# EAGLE design CPU_HCS12C (EAGLE 6.5.0)
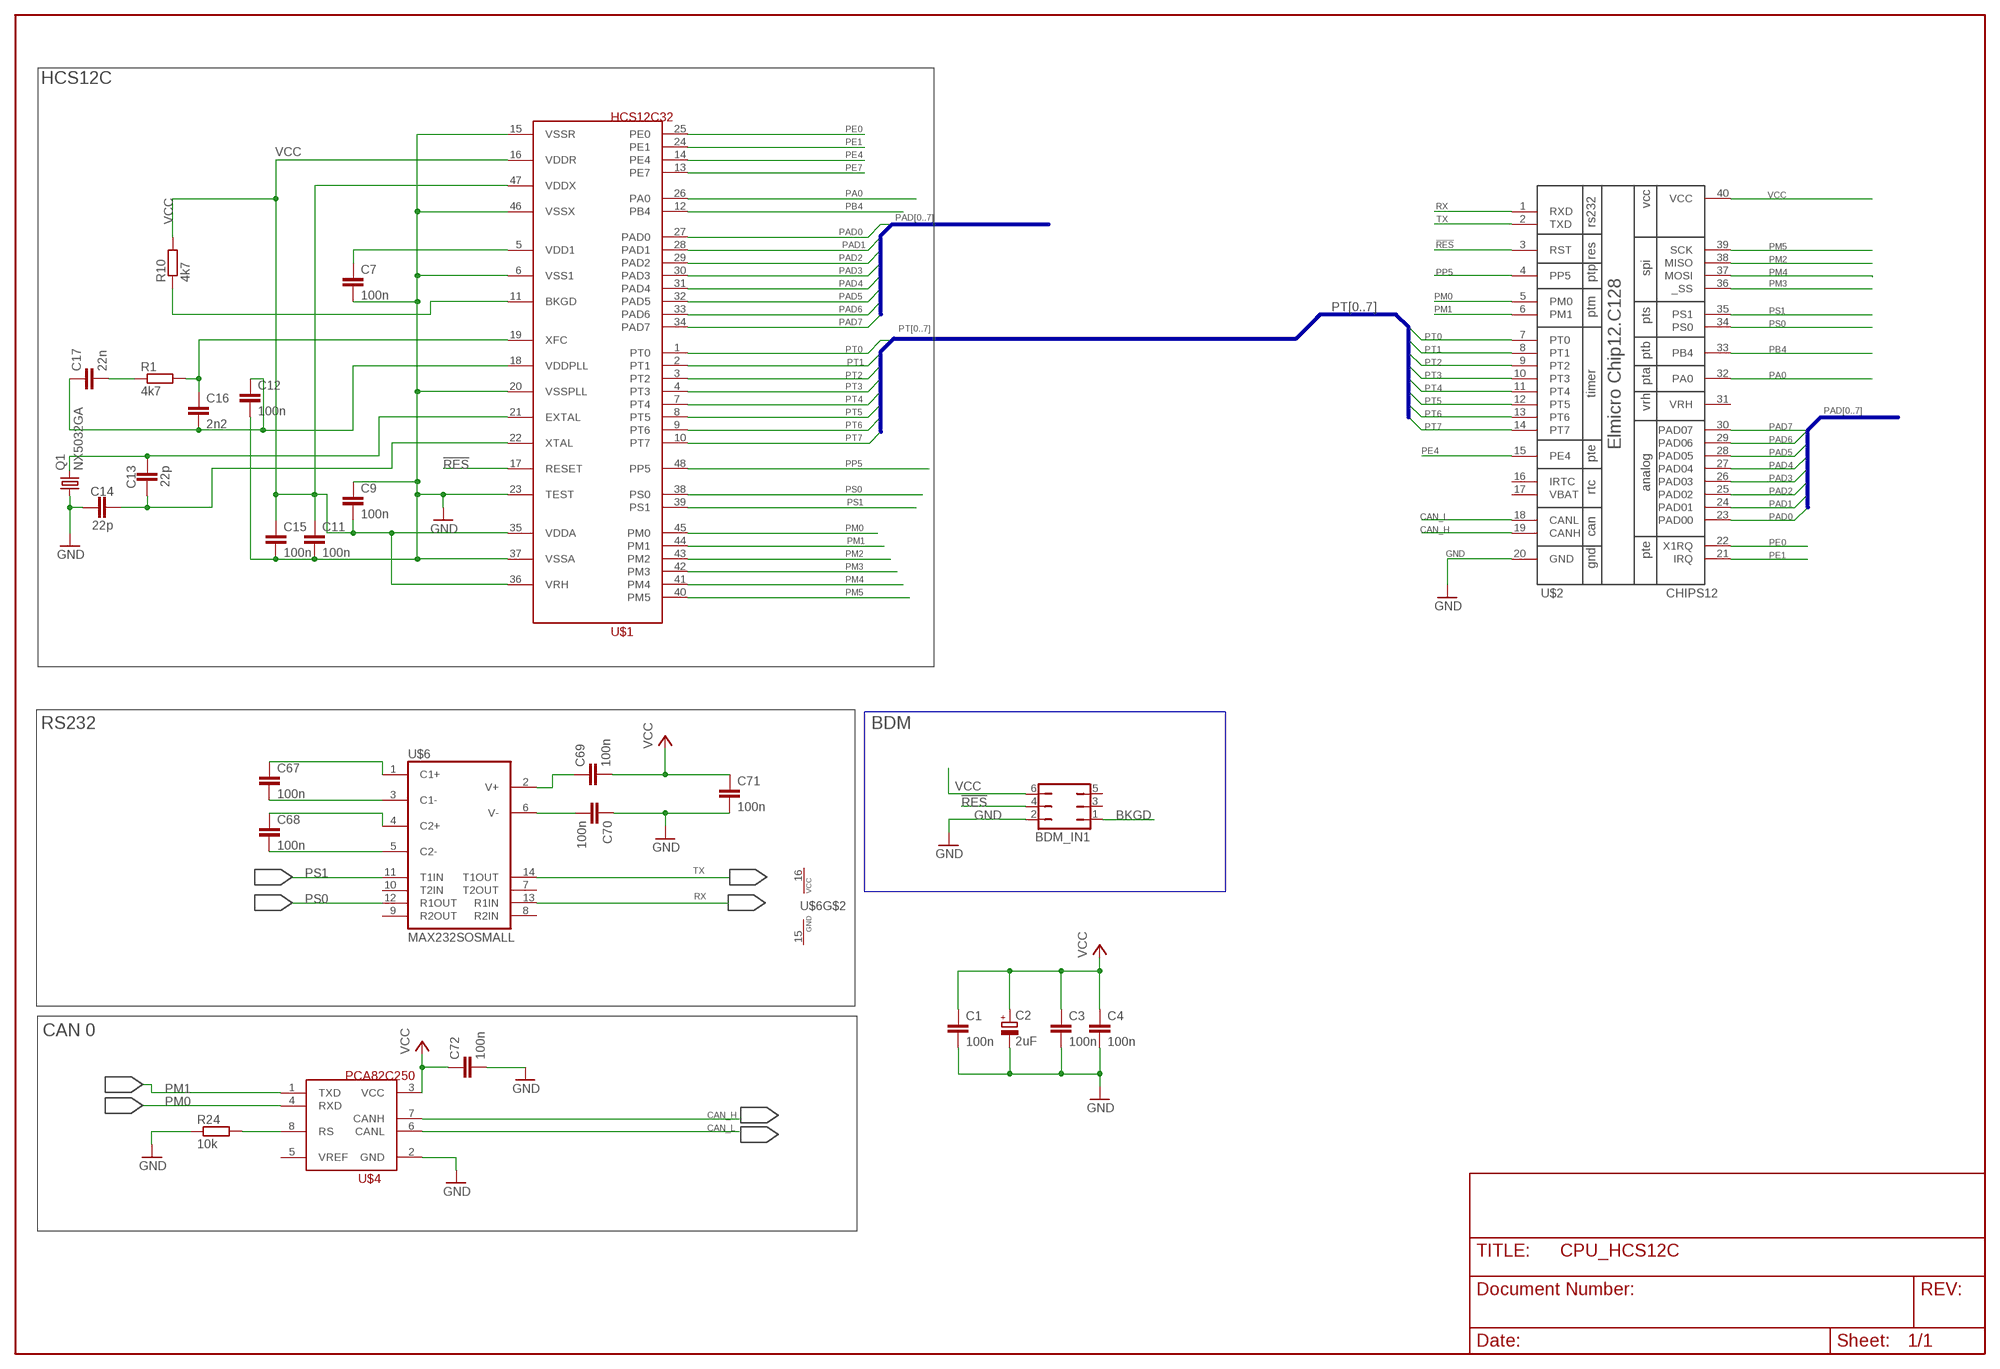
[diagram p0: schematic, sheet 1]

## Parts
BDM_IN1  JP3Q  [JP3Q]
C1  100n  C-EUC0805  [C0805]
C2  2uF  CPOL-EUCT3528  [CT3528]
C3  100n  C-EUC0805  [C0805]
C4  100n  C-EUC0805  [C0805]
C7  100n  C-EUC0603  [C0603]
C9  100n  C-EUC0603  [C0603]
C11  100n  C-EUC0603  [C0603]
C12  100n  C-EUC0603  [C0603]
C13  22p  C-EUC0805K  [C0805K]
C14  22p  C-EUC0805K  [C0805K]
C15  100n  C-EUC0603  [C0603]
C16  2n2  C-EUC0603  [C0603]
C17  22n  C-EUC0603  [C0603]
C67  100n  C-EUC0805  [C0805]
C68  100n  C-EUC0805  [C0805]
C69  100n  C-EUC0805  [C0805]
C70  100n  C-EUC0805  [C0805]
C71  100n  C-EUC0805  [C0805]
C72  100n  C-EUC0805  [C0805]
Q1  NX5032GA  [5032]
R1  4k7  R-EU_M0805  [M0805]
R10  4k7  R-EU_M0805  [M0805]
R24  10k  R-EU_M0805  [M0805]
U$1  HCS12C32  [LQFP48]
U$2  CHIPS12  [DIL40]
U$4  PCA82C250  [SO8@1]
U$6  MAX232SOSMALL  [SO16]

## Nets
!RES: BDM_IN1.4 U$1.17(RESET) U$2.3(RST)
BKGD: BDM_IN1.1 R10.1 U$1.11(BKGD)
CAN_H: U$2.19(CANH) U$4.7(CANH)
CAN_L: U$2.18(CANL) U$4.6(CANL)
GND: BDM_IN1.2 C1.2 C2.- C3.2 C4.2 C7.2 C9.1 C11.2 C12.2 C14.2 C15.2 C70.1 C71.2 C72.2 Q1.1 R24.1 U$1.6(VSS1) U$1.15(VSSR) U$1.20(VSSPLL) U$1.23(TEST) U$1.37(VSSA) U$1.46(VSSX) U$2.20(GND) U$4.2(GND)
N$2: C7.1 U$1.5(VDD1)
N$3: C13.1 Q1.2 U$1.21(EXTAL)
N$4: C68.1 U$6.4(C2+)
N$6: C16.1 R1.2 U$1.19(XFC)
N$7: C12.1 C16.2 C17.1 U$1.18(VDDPLL)
N$8: C17.2 R1.1
N$10: C13.2 C14.1 U$1.22(XTAL)
N$11: C67.1 U$6.1(C1+)
N$13: C67.2 U$6.3(C1-)
N$54: C68.2 U$6.5(C2-)
N$55: C70.2 U$6.6(V-)
N$56: C69.1 U$6.2(V+)
N$57: R24.2 U$4.8(RS)
PA0: U$1.26(PA0) U$2.32(PA0)
PAD0: U$1.27(PAD0) U$2.23(PAD00)
PAD1: U$1.28(PAD1) U$2.24(PAD01)
PAD2: U$1.29(PAD2) U$2.25(PAD02)
PAD3: U$1.30(PAD3) U$2.26(PAD03)
PAD4: U$1.31(PAD4) U$2.27(PAD04)
PAD5: U$1.32(PAD5) U$2.28(PAD05)
PAD6: U$1.33(PAD6) U$2.29(PAD06)
PAD7: U$1.34(PAD7) U$2.30(PAD07)
PB4: U$1.12(PB4) U$2.33(PB4)
PE0: U$1.25(PE0) U$2.22(X1RQ)
PE1: U$1.24(PE1) U$2.21(IRQ)
PE4: U$1.14(PE4) U$2.15(PE4)
PE7: U$1.13(PE7)
PM0: U$1.45(PM0) U$2.5(PM0) U$4.4(RXD)
PM1: U$1.44(PM1) U$2.6(PM1) U$4.1(TXD)
PM2: U$1.43(PM2) U$2.38(MISO)
PM3: U$1.42(PM3) U$2.36(_SS)
PM4: U$1.41(PM4) U$2.37(MOSI)
PM5: U$1.40(PM5) U$2.39(SCK)
PP5: U$1.48(PP5) U$2.4(PP5)
PS0: U$1.38(PS0) U$2.34(PS0) U$6.12(R1OUT)
PS1: U$1.39(PS1) U$2.35(PS1) U$6.11(T1IN)
PT0: U$1.1(PT0) U$2.7(PT0)
PT1: U$1.2(PT1) U$2.8(PT1)
PT2: U$1.3(PT2) U$2.9(PT2)
PT3: U$1.4(PT3) U$2.10(PT3)
PT4: U$1.7(PT4) U$2.11(PT4)
PT5: U$1.8(PT5) U$2.12(PT5)
PT6: U$1.9(PT6) U$2.13(PT6)
PT7: U$1.10(PT7) U$2.14(PT7)
RX: U$2.1(RXD) U$6.13(R1IN)
TX: U$2.2(TXD) U$6.14(T1OUT)
VCC: BDM_IN1.6 C1.1 C2.+ C3.1 C4.1 C9.2 C11.1 C15.1 C69.2 C71.1 C72.1 R10.2 U$1.16(VDDR) U$1.35(VDDA) U$1.36(VRH) U$1.47(VDDX) U$2.40(VCC) U$4.3(VCC)
Unconnected: BDM_IN1.3 BDM_IN1.5 U$2.16(IRTC) U$2.17(VBAT) U$2.31(VRH) U$4.5(VREF) U$6.7(T2OUT) U$6.8(R2IN) U$6.9(R2OUT) U$6.10(T2IN)

## Buses
B$1
PT[0..7]
PAD[0..7]

## Notes on the sheet
- HCS12C
- RS232 | BDM
- CAN 0

## Power pins joined to a net without a drawn wire
GND: U$6.15(GND)
VCC: U$6.16(VCC)

## Library data of the parts
BDM_IN1 = jumper:JP3Q: JUMPER
C1 C3 C4 C7 C9 C11-C17 C67-C72 = rcl:C-EU: CAPACITOR, European symbol
C2 = rcl:CPOL-EU: POLARIZED CAPACITOR, European symbol
Q1 = crystal:NX5032GA
R1 R10 R24 = rcl:R-EU_: RESISTOR, European symbol
U$1 = Freescale_HCS12C:HCS12C32
U$2 = elmicro:CHIPS12: ChipS12.128 from Elmicro (www.elmicro.com)
U$4 = philips:PCA82C250: CAN Phy Driver SMD
U$6 = maxim:MAX232SOSMALL

## Board
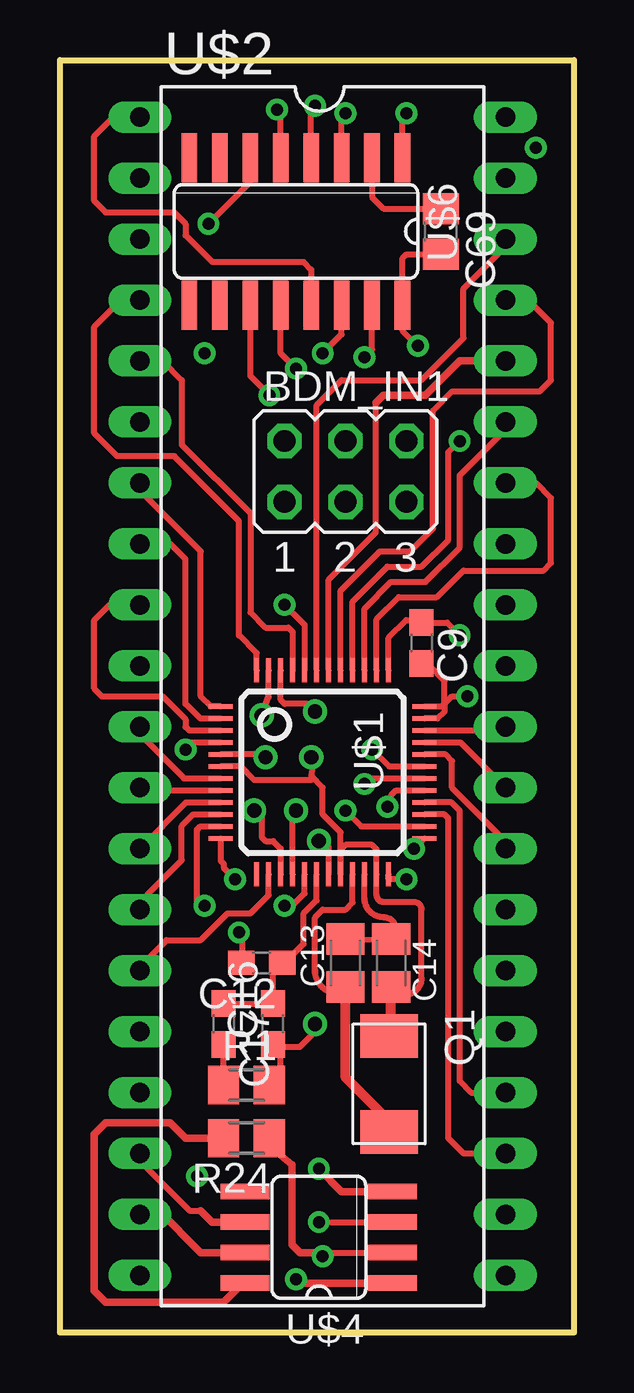
[diagram p1: board, top side]
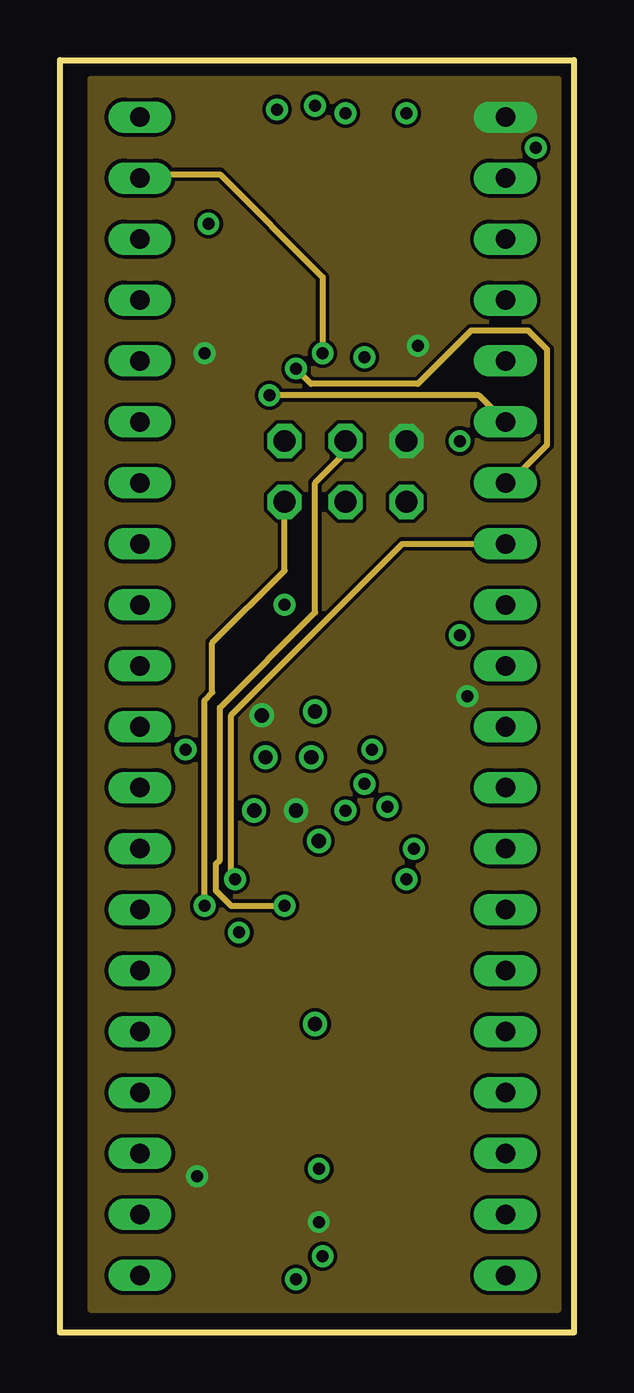
[diagram p2: board, inner layer Route2]
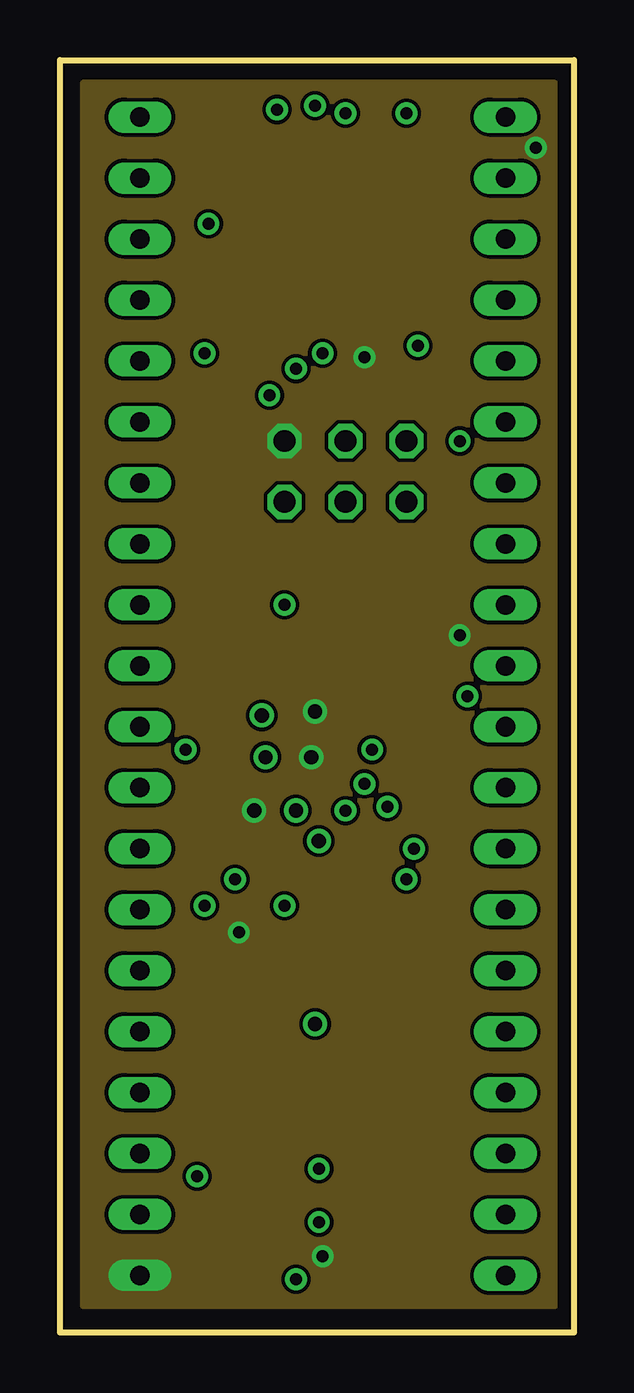
[diagram p3: board, inner layer Route3]
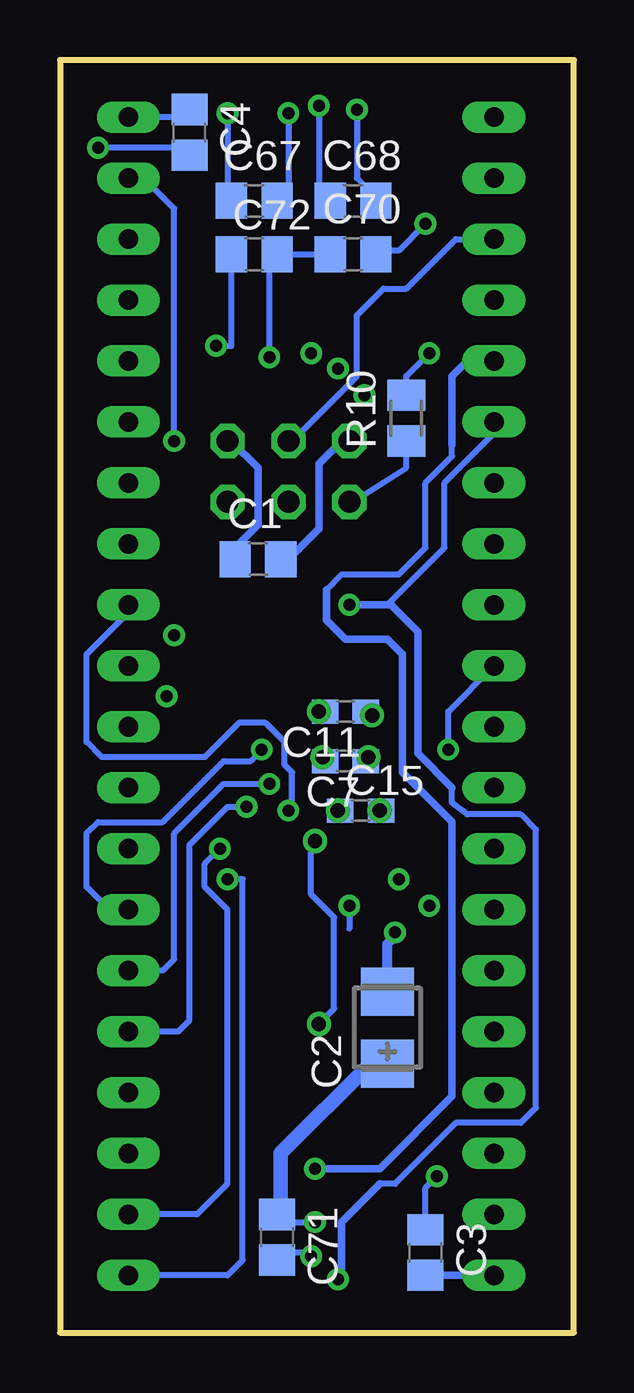
[diagram p4: board, bottom side, seen from below]

Size 21.43 x 53.02 mm. Coordinates in mm from the lower left corner, seen from the top.
Outline: 0,0 0,53.02 21.43,53.02 21.43,0 0,0
Copper layers (1*2*3*16): Top 0.035mm / dielectric 1.5mm / Route2 0.035mm / dielectric 0.15mm / Route3 0.035mm / dielectric 0.2mm / Bottom 0.035mm
Design rules "default *": minimum track width 6mil, minimum drill 12mil, track to track 6mil, track to pad 8mil, pad to pad 8mil, via to via 8mil, smd to smd 8mil, copper to edge 6mil, drill to drill 8mil, minimum pad ring 10mil, minimum via ring 8mil, stop-mask expansion 4mil, vias tented up to drill 0mil, thermal gap 10mil

### Footprints (pad centres in the part's own frame; a part is rotated, then mirrored left to right if it is on the bottom)
JP3Q = drill 0.914 octagon: 1 -2.54,-1.27; 2 -2.54,1.27; 3 0,-1.27; 4 0,1.27; 5 2.54,-1.27; 6 2.54,1.27
C0805 = smd 1.3 x 1.5: 1 -0.95,0; 2 0.95,0
CT3528 = smd 2 x 2.2: + -1.5,0; - 1.5,0
C0603 = smd 1.1 x 1: 1 -0.85,0; 2 0.85,0
C0805K = smd 1.3 x 1.6: 1 -1,0; 2 1,0
5032 = smd 1.8 x 2.4: 1 0.5,1.5; 2 4.5,1.5
M0805 = smd 1.3 x 1.6: 1 -0.95,0; 2 0.95,0
LQFP48 = smd 0.2 x 1: 1 -2.75,-4.25; 2 -2.25,-4.25; 3 -1.75,-4.25; 4 -1.25,-4.25; 5 -0.75,-4.25; 6 -0.25,-4.25; 7 0.25,-4.25; 8 0.75,-4.25; 9 1.25,-4.25; 10 1.75,-4.25; 11 2.25,-4.25; 12 2.75,-4.25; 25 2.75,4.25; 26 2.25,4.25; 27 1.75,4.25; 28 1.25,4.25; 29 0.75,4.25; 30 0.25,4.25; 31 -0.25,4.25; 32 -0.75,4.25; 33 -1.25,4.25; 34 -1.75,4.25; 35 -2.25,4.25; 36 -2.75,4.25 | smd 1 x 0.2: 13 4.25,-2.75; 14 4.25,-2.25; 15 4.25,-1.75; 16 4.25,-1.25; 17 4.25,-0.75; 18 4.25,-0.25; 19 4.25,0.25; 20 4.25,0.75; 21 4.25,1.25; 22 4.25,1.75; 23 4.25,2.25; 24 4.25,2.75; 37 -4.25,2.75; 38 -4.25,2.25; 39 -4.25,1.75; 40 -4.25,1.25; 41 -4.25,0.75; 42 -4.25,0.25; 43 -4.25,-0.25; 44 -4.25,-0.75; 45 -4.25,-1.25; 46 -4.25,-1.75; 47 -4.25,-2.25; 48 -4.25,-2.75
DIL40 = drill 0.813 long: 1 -24.13,-7.62; 2 -21.59,-7.62; 3 -19.05,-7.62; 4 -16.51,-7.62; 5 -13.97,-7.62; 6 -11.43,-7.62; 7 -8.89,-7.62; 8 -6.35,-7.62; 9 -3.81,-7.62; 10 -1.27,-7.62; 11 1.27,-7.62; 12 3.81,-7.62; 13 6.35,-7.62; 14 8.89,-7.62; 15 11.43,-7.62; 16 13.97,-7.62; 17 16.51,-7.62; 18 19.05,-7.62; 19 21.59,-7.62; 20 24.13,-7.62; 21 24.13,7.62; 22 21.59,7.62; 23 19.05,7.62; 24 16.51,7.62; 25 13.97,7.62; 26 11.43,7.62; 27 8.89,7.62; 28 6.35,7.62; 29 3.81,7.62; 30 1.27,7.62; 31 -1.27,7.62; 32 -3.81,7.62; 33 -6.35,7.62; 34 -8.89,7.62; 35 -11.43,7.62; 36 -13.97,7.62; 37 -16.51,7.62; 38 -19.05,7.62; 39 -21.59,7.62; 40 -24.13,7.62
SO8@1 = smd 0.66 x 2.032: 1 -3.175,-5.613; 2 -1.905,-5.613; 3 -0.635,-5.613; 4 0.635,-5.613; 5 0.635,0.533; 6 -0.635,0.533; 7 -1.905,0.533; 8 -3.175,0.533
SO16 = smd 0.66 x 2.032: 1 -4.445,-3.073; 2 -3.175,-3.073; 3 -1.905,-3.073; 4 -0.635,-3.073; 5 0.635,-3.073; 6 1.905,-3.073; 7 3.175,-3.073; 8 4.445,-3.073; 9 4.445,3.073; 10 3.175,3.073; 11 1.905,3.073; 12 0.635,3.073; 13 -0.635,3.073; 14 -1.905,3.073; 15 -3.175,3.073; 16 -4.445,3.073

### Placement (x,y rotation side)
BDM_IN1  11.91,35.88 0 top
C1  13.18,32.23 0 bottom
C2  7.78,12.7 90 bottom
C3  6.19,3.33 270 bottom
C4  16.03,50.01 270 bottom
C7  9.53,23.81 180 bottom
C9  15.08,28.73 270 top
C11  9.53,25.88 180 bottom
C12  8.41,15.4 180 top
C13  11.91,15.4 90 top
C14  13.81,15.4 270 top
C15  8.89,21.75 0 bottom
C16  8.89,12.86 90 top
C17  6.83,12.86 270 top
C67  13.33,47.15 0 bottom
C68  9.21,47.15 0 bottom
C69  15.88,45.88 270 top
C70  9.21,44.93 0 bottom
C71  12.38,3.97 270 bottom
C72  13.33,44.93 0 bottom
Q1  12.22,12.86 270 top
R1  7.78,10.32 0 top
R10  6.98,38.1 90 bottom
R24  7.78,8.1 180 top
U$1  10.95,23.34 270 top
U$2  10.95,26.51 270 top
U$4  8.26,5.24 90 top
U$6  9.84,45.88 180 top

### Tracks (layer width: path | path; a pad name or v marks a point on that pad's centre or on a via)
!RES  (via drill 0.5)
  Top 0.254: U$1.17 10.2,18.3 9.68,17.78 v9.37,17.78
  Route2 0.254: BDM_IN1.4 11.91,36.67 10.64,35.4 10.64,30 6.67,26.03 6.67,19.68 6.51,19.53 6.51,18.41 7.14,17.78 v9.37,17.78
  Bottom 0.254: v9.37,17.78 9.37,16.83 | BDM_IN1.4 11.75,37.15 9.05,39.85 9.05,42.39 7.94,43.5 6.99,43.5 4.92,45.56 U$2.3
BKGD  (via drill 0.5)
  Top 0.254: U$1.11 5.85,21.09 5.72,20.95 5.72,17.94 v6.03,17.78
  Route2 0.254: BDM_IN1.1 9.37,31.75 6.35,28.73 6.35,26.67 6.03,26.35 v6.03,17.78
  Bottom 0.254: BDM_IN1.1 9.21,34.61 6.99,36.04 R10.1
CAN_H
  Top 0.305: U$4.7 5.87,3.33 4.13,5.08 3.33,5.08 U$2.19
CAN_L
  Top 0.254: U$2.18 3.33,7.14 5.4,5.08 5.87,5.08
  Top 0.305: U$4.6 6.35,4.6 5.87,5.08
GND  (via drill 0.5, 0.6)
  Top 0.254: C14.2 13.81,14.45 arc152 15.08,14.76 15.08,17.62 arc90 14.76,17.94 13.49,17.94 arc-90 13.2,18.23 U$1.23 13.2,20.13 13.02,20.32 11.91,20.32 11.7,20.12 U$1.20 11.7,20.84 10.95,21.59 10.95,22.7 10.48,23.18 | v10.64,25.88 10.32,26.19 9.37,26.19 9.2,26.36 U$1.46 | U$1.37 13.7,28.94 14.45,29.69 15.08,29.69 15.08,29.53 | U$1.6 7.53,23.59 8.1,23.02 10.48,23.02 10.5,23.18 | 10.5,23.18 10.55,23.59 10.64,23.65 v10.48,23.97 | U$1.15 9.2,20.16 8.89,20.48 8.57,20.48 8.41,20.64 8.41,21.59 v8.1,21.75 | C12.2 7.62,16.83 v7.46,16.67 | 10.48,23.18 | 10.48,23.18 10.5,23.18 | v16.67,29.05 16.14,29.58 C9.1 15.08,29.53 | 15.08,29.53 | U$4.2 11.27,3.33 v10.95,3.17 | U$6.15 13.02,40.96 v12.7,40.64
  Top 0.305: R24.1 8.73,7.78 9.68,6.98 9.68,3.65 10,3.33 11.11,3.33 v10.95,3.17
  Top 0.406: 13.81,12.36 13.81,12.22 | Q1.1 13.81,12.36 | 13.81,12.36 C14.2
  Bottom 0.254: 10.64,25.56 v10.64,25.88 C11.2 | C71.2 12.54,3.18 12.54,3.33 11.11,3.33 v10.95,3.17 | v12.7,40.64 12.7,44.61 C72.2 C70.1 | C7.2 10.32,23.81 | C7.2 | v10.48,23.97 10.48,23.81 C7.2 | C15.2 v8.1,21.75 | C15.2 | C4.2 16.35,49.37 v19.84,49.37
  Bottom 0.305: C1.2 11.91,32.23 10.64,33.5 10.64,36.19 9.68,37.15 BDM_IN1.2 | U$2.20 3.49,2.38 3.5,2.38 C3.2
  Bottom 0.406: v7.46,16.67 7.46,16.51 7.78,16.19 C2.-
  pour Route3 (no thermals): 0.95,52.07 0.95,1.11 20.64,1.11 20.64,52.07
N$2  (via drill 0.6)
  Top 0.254: U$1.5 8.53,24.09 v8.57,23.97
  Bottom 0.254: v8.57,23.97 8.57,23.81 C7.1 | C7.1
N$3
  Top 0.254: U$1.21 12.2,17.92 11.91,17.62 10.95,17.62 10.64,17.3 10.64,15.08 arc90 11.59,14.13 arc-90 11.86,14.4 C13.1
  Top 0.406: C13.1 11.91,10.64 13.49,9.05 13.49,8.41 13.55,8.36 Q1.2
N$4  (via drill 0.5)
  Top 0.254: U$6.4 10.48,50.96 v10.64,51.12
  Bottom 0.254: C68.1 10.64,47.62 v10.64,51.12
N$6  (via drill 0.6)
  Top 0.254: U$1.19 11.2,20.23 v10.8,20.48 | v10.64,12.86 10.64,12.54 10,11.91 9.21,11.91 | C16.1 8.99,12.01 9.05,12.06 9.21,11.91 | R1.2 8.57,10.48 9.21,11.11 9.21,11.91
  Bottom 0.254: v10.8,20.48 10.8,20.16 10.95,20 10.95,18.26 10,17.3 10,13.49 v10.64,12.86
N$7
  Top 0.254: 8.89,13.81 | 8.89,13.81 C16.2 | C17.1 8.79,13.71 8.89,13.81 | 8.89,13.81 8.89,14.92 9.37,15.4 | U$1.18 10.7,18.01 10.16,17.46 10.16,16.19 9.37,15.4 | 9.37,15.4 C12.1
N$8
  Top 0.254: R1.1 6.67,10.32 6.83,10.48 C17.2
N$10
  Top 0.254: U$1.22 12.7,18.09 arc90 13.49,17.3 arc-143 13.81,16.35 | 13.81,16.35 C14.1 | C13.2 13.81,16.35
N$11  (via drill 0.5)
  Top 0.254: U$6.1 14.29,50.8 v14.45,50.8
  Bottom 0.254: C67.1 14.13,47.15 | C67.1 | v14.45,50.8 14.45,47.15 C67.1
N$13  (via drill 0.5)
  Top 0.254: U$6.3 11.75,50.64 v11.91,50.8
  Bottom 0.254: C67.2 11.91,47.62 v11.91,50.8
N$54  (via drill 0.5)
  Top 0.254: U$6.5 9.21,50.8 v9.05,50.96
  Bottom 0.254: 8.1,47.15 | 8.1,47.15 C68.2 | v9.05,50.96 9.05,48.1 8.1,47.15
N$55  (via drill 0.5)
  Top 0.254: U$6.6 7.94,47.94 v6.19,46.2
  Bottom 0.254: v6.19,46.2 | v6.19,46.2 7.3,45.08 8.1,45.08 C70.2
N$56
  Top 0.254: U$6.2 13.02,47.31 13.49,46.83 C69.1
N$57
  Top 0.305: R24.2 5.24,8.1 4.6,8.73 1.91,8.73 1.43,8.25 1.43,1.75 1.91,1.27 6.83,1.27 7.62,2.06 U$4.8
PA0  (via drill 0.5)
  Top 0.254: U$1.26 12.57,21.09 v11.91,21.75
  Bottom 0.254: 11.75,22.07 v11.91,21.75 11.75,21.91 11.75,23.34 12.07,23.65 12.07,24.61 12.86,25.4 13.97,25.4 15.4,23.97 19.69,23.97 20.32,24.61 20.32,28.26 18.57,30 U$2.32
PAD0
  Top 0.254: U$1.27 16.04,21.59 16.19,21.43 16.19,8.1 16.83,7.46 U$2.23
PAD1
  Top 0.254: U$1.28 16.33,22.09 16.67,21.75 16.67,10.48 17.15,10 U$2.24 18.73,10
PAD2  (via drill 0.5)
  Top 0.254: U$1.29 14.01,22.59 13.81,22.38 13.81,22.07 v13.65,21.91
  Bottom 0.254: v13.65,21.91 14.45,21.91 16.03,20.32 16.03,13.02 16.51,12.54 U$2.25 | U$2.25 | U$2.25 18.73,12.38
PAD3  (via drill 0.5)
  Top 0.254: U$1.30 12.93,23.09 v12.7,22.86
  Bottom 0.254: v12.7,22.86 14.61,22.86 16.67,20.8 16.67,15.56 17.15,15.08 U$2.26
PAD4  (via drill 0.5)
  Top 0.254: U$1.31 13.72,23.59 v13.02,24.29
  Bottom 0.254: U$2.27 19.37,17.62 20.32,18.57 20.32,20.8 19.84,21.27 17.15,21.27 14.61,23.81 13.49,23.81 v13.02,24.29
PAD5
  Top 0.254: U$1.32 16.08,24.09 16.35,23.81 16.35,22.7 18.57,20.48 U$2.28
PAD6
  Top 0.254: U$1.33 16.69,24.59 U$2.29
PAD7
  Top 0.254: U$1.34 18.42,25.09 U$2.30
PB4  (via drill 0.5)
  Top 0.254: U$1.12 6.7,19.65 6.83,19.53 6.83,19.37 v7.3,18.89
  Route2 0.254: U$2.33 14.29,32.86 7.14,25.72 7.14,19.05 v7.3,18.89
PE0  (via drill 0.5)
  Top 0.254: U$1.25 14.78,20.16 v14.76,20.16
  Bottom 0.254: v14.76,20.16 15.4,19.53 15.4,18.57 14.45,17.62 14.45,6.19 15.72,4.92 U$2.22
PE1  (via drill 0.5)
  Top 0.254: U$1.24 13.7,18.89 v14.45,18.89
  Bottom 0.254: v14.45,18.89 13.81,18.89 13.81,3.02 14.45,2.38 U$2.21
PE4
  Top 0.254: U$1.14 8.7,18.23 7.94,17.46 6.99,17.46 5.87,16.35 4.45,16.35 3.33,15.24 U$2.15
PM0  (via drill 0.5)
  Top 0.254: 3.18,40.48 U$2.5 4.29,40.48 5.08,39.69 5.08,36.99 7.94,34.13 7.94,30 8.57,29.37 9.53,29.37 9.7,29.19 U$1.45
  Top 0.305: U$4.4 11.75,5.87 v10.8,6.83
  Bottom 0.254: 5.08,36.99 5.08,36.51 6.19,35.4 6.19,32.7 7.3,31.59 9.68,31.59 10.32,30.96
  Bottom 0.305: v10.8,6.83 8.1,6.83 5.08,9.84 5.08,21.27 7.14,23.34 7.14,28.26 7.78,28.89 9.53,28.89 10.32,29.69 10.32,30.96 | 5.08,36.99 5.08,39.85 4.45,40.48 U$2.5
PM1  (via drill 0.5)
  Top 0.254: U$1.44 10.2,29.48 v9.37,30.32
  Top 0.305: U$4.1 10,2.06 v9.84,2.22
  Bottom 0.254: U$2.6 3.33,37.46 5.4,35.4 5.4,32.7 7.78,30.32 | 5.08,22.7 5.08,22.07 4.45,21.59 2.22,21.59 1.59,20.95 1.59,9.37 2.22,8.73 4.92,8.73 7.46,6.19 8.1,6.19
  Bottom 0.305: 5.08,22.7 6.51,24.13 6.51,29.21 7.62,30.32 7.78,30.32 v9.37,30.32 | 8.1,6.19 9.68,4.6 9.68,2.38 v9.84,2.22
PM2
  Top 0.254: U$1.43 10.7,38.64 11.75,39.69 15.08,39.69 16.83,41.43 16.83,43.5 18.57,45.24 U$2.38 18.57,45.72
PM3
  Top 0.254: U$1.42 11.2,31.36 13.18,33.34 13.18,38.73
  Top 0.305: 13.18,38.73 13.49,39.05 15.24,39.05 16.67,40.48 U$2.36
PM4
  Top 0.254: U$1.41 11.7,30.91 13.34,32.54 14.61,32.54 15.56,33.5 15.56,38.42 16.35,39.21 20,39.21 20.48,39.69 20.48,42.07 19.37,43.18 18.73,43.18 U$2.37
PM5  (via drill 0.5)
  Top 0.254: U$1.40 12.2,30.46 13.65,31.91 15.08,31.91 16.19,33.02 16.19,36.67 v16.67,37.15
  Bottom 0.254: v16.67,37.15 16.67,46.83 17.94,48.1 18.42,48.1 18.57,48.26 U$2.39
PP5
  Top 0.254: U$2.4 2.54,43.02 1.43,41.91 1.43,37.46 2.38,36.51 4.76,36.51 7.46,33.81 7.46,29.05 8.2,28.31 U$1.48
PS0  (via drill 0.5)
  Top 0.254: U$1.38 13.2,29.71 14.13,30.64 15.72,30.64 16.83,31.75 20.16,31.75 20.48,32.07 20.48,34.77 19.84,35.4 U$2.34 | U$6.12 9.21,40.8 v9.84,40.16
  Route2 0.254: v9.84,40.16 10.48,39.53 14.92,39.53 17.15,41.75 19.53,41.75 20.32,40.96 20.32,36.99 18.73,35.4 U$2.34
PS1  (via drill 0.5)
  Top 0.254: U$1.39 12.7,30.17 13.81,31.27 15.24,31.27 16.67,32.7 16.67,35.72 18.57,37.62 U$2.35 | U$6.11 7.94,39.85 v8.73,39.05
  Route2 0.254: v8.73,39.05 17.46,39.05 U$2.35
PT0
  Top 0.254: U$1.1 6.3,26.09 5.87,26.51 5.87,32.54 3.33,35.08 U$2.7
PT1
  Top 0.254: U$1.2 5.85,25.59 5.24,26.19 5.24,32.23 4.6,32.86 U$2.8
PT2
  Top 0.254: U$1.3 5.39,25.09 5.24,25.24 5.24,25.56 4.29,26.51 1.75,26.51 1.43,26.83 1.43,29.69 2.06,30.32 U$2.9
PT3  (via drill 0.5)
  Top 0.254: U$1.4 5.54,24.59 arc90 v5.24,24.29
  Bottom 0.254: v5.24,24.29 5.24,25.88 U$2.10
PT4
  Top 0.254: U$2.11 3.33,24.92 5.17,23.09 U$1.7
PT5
  Top 0.254: U$1.8 3.45,22.59 U$2.12
PT6
  Top 0.254: U$1.9 5.26,22.09 U$2.13
PT7
  Top 0.254: U$1.10 5.55,21.59 5.08,21.11 5.08,19.68 3.65,18.26 3.65,17.94 U$2.14
RX
  Top 0.254: U$6.13 10.48,44.29 10.16,44.61 6.35,44.61 5.24,45.72 5.24,46.2 4.76,46.67 1.91,46.67 1.43,47.15 1.43,49.85 2.38,50.8 3.33,50.8 U$2.1
TX  (via drill 0.5)
  Top 0.254: U$6.14 11.75,41.59 v10.95,40.8
  Route2 0.254: v10.95,40.8 10.95,43.97 6.67,48.26 3.65,48.26 3.33,47.94 U$2.2
VCC  (via drill 0.5, 0.6)
  Top 0.254: U$1.47 8.7,26.48 v8.41,25.72 | U$1.35 15.74,25.59 16.03,25.88 16.03,26.19 | 16.03,26.19 16.03,27.15 15.4,27.78 15.35,27.73 15.13,27.73 15.08,27.78 | U$1.36 15.93,26.09 16.03,26.19 | U$1.16 9.7,22.09 v9.84,21.75 | 15.08,27.78 | 15.08,27.78 C9.2 | v16.99,26.51 16.35,26.51 16.03,26.19 | v10.8,4.6 U$4.3 | C69.2 14.45,44.93 14.29,44.77 14.29,42.7 | 14.29,42.7 | 14.29,42.7 U$6.16 | 14.29,42.7 14.29,41.75 v14.92,41.12
  Bottom 0.254: 8.68,25.51 8.73,25.56 8.57,25.72 v8.41,25.72 C11.1 | C71.1 12.38,4.76 12.54,4.6 v10.8,4.6 | R10.2 6.99,39.85 v6.03,40.8 | C15.1 9.68,21.75 | C15.1 | v9.84,21.75 C15.1 | C72.1 14.29,41.12 v14.92,41.12 | C3.1 6.19,6.03 v5.72,6.51 | C4.1 16.19,50.96 16.51,50.64 U$2.40
  Bottom 0.305: C1.1 14.13,32.7 13.18,33.65 13.18,36.04 14.29,37.15 BDM_IN1.6
  Bottom 0.61: C2.+ 8.49,11.2 12.22,7.46 12.22,4.92 12.23,4.92 C71.1
  pour Route2 (no thermals): 1.27,52.23 1.27,0.95 20.8,0.95 20.8,52.23